# Altium schematic sheet SPI_Module.SchDoc
size A0
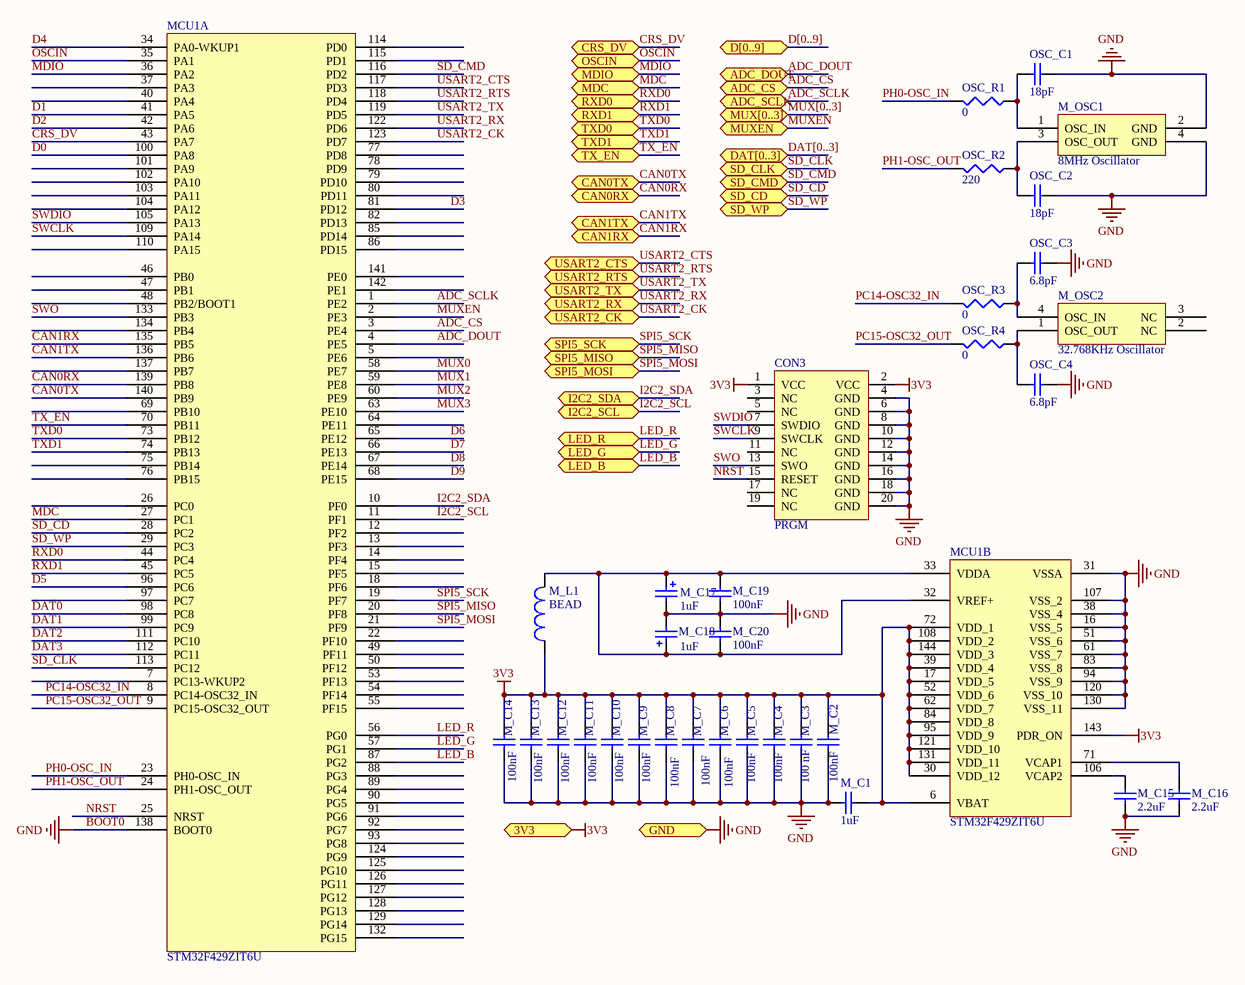
[diagram p0: SPI_Module.SchDoc]

## Parts
CON3  PRGM  [JTAG/SWO-20PIN]
M_C1  value 1uF  [SMD0603]  (hidden comment: Cap)
M_C2  value 100nF  [SMD0603]  (hidden comment: Cap)
M_C3  value 100 nF  [SMD0603]  (hidden comment: Cap)
M_C4  value 100nF  [SMD0603]  (hidden comment: Cap)
M_C5  value 100nF  [SMD0603]  (hidden comment: Cap)
M_C6  value 100nF  [SMD0603]  (hidden comment: Cap)
M_C7  value 100nF  [SMD0603]  (hidden comment: Cap)
M_C8  value 100nF  [SMD0603]  (hidden comment: Cap)
M_C9  value 100nF  [SMD0603]  (hidden comment: Cap)
M_C10  value 100nF  [SMD0603]  (hidden comment: Cap)
M_C11  value 100nF  [SMD0603]  (hidden comment: Cap)
M_C12  value 100nF  [SMD0603]  (hidden comment: Cap)
M_C13  value 100nF  [SMD0603]  (hidden comment: Cap)
M_C14  value 100nF  [SMD0603]  (hidden comment: Cap)
M_C15  value 2.2uF  [SMD1206]  (hidden comment: Cap)
M_C16  value 2.2uF  [SMD1206]  (hidden comment: Cap)
M_C17  value 1uF  [SMD1206 Polarized]  (hidden comment: Cap)
M_C18  value 1uF  [SMD1206 Polarized]  (hidden comment: Cap)
M_C19  value 100nF  [SMD0603]  (hidden comment: Cap)
M_C20  value 100nF  [SMD0603]  (hidden comment: Cap)
M_L1  BEAD  [SMD0603]
M_OSC1  8MHz Oscillator  [ABMM2-OSC]
M_OSC2  32.768KHz Oscillator  [MC-306-OSC]
MCU1  STM32F429ZIT6U  [LQPF144]  (parts A,B of 2)
OSC_C1  value 18pF  [SMD0603]  (hidden comment: Cap)
OSC_C2  value 18pF  [SMD0603]  (hidden comment: Cap)
OSC_C3  value 6.8pF  [SMD0603]  (hidden comment: Cap)
OSC_C4  value 6.8pF  [SMD0603]  (hidden comment: Cap)
OSC_R1  value 0  [SMD0603]  (hidden comment: Res)
OSC_R2  value 220  [SMD0603]  (hidden comment: Res)
OSC_R3  value 0  [SMD0603]  (hidden comment: Res)
OSC_R4  value 0  [SMD0603]  (hidden comment: Res)

## Ports
3V3, ADC_CS, ADC_DOUT, ADC_SCLK, CAN0RX, CAN0TX, CAN1RX, CAN1TX, CRS_DV, D[0..9], DAT[0..3], GND, I2C2_SCL, I2C2_SDA, LED_B, LED_G, LED_R, MDC, MDIO, MUX[0..3], MUXEN, OSCIN, RXD0, RXD1, SD_CD, SD_CLK, SD_CMD, SD_WP, SPI5_MISO, SPI5_MOSI, SPI5_SCK, TX_EN, TXD0, TXD1, USART2_CK, USART2_CTS, USART2_RTS, USART2_RX, USART2_TX

## Nets
3V3: CON3.1(VCC) CON3.2(VCC) M_C1.1 M_C2.1 M_C3.2 M_C4.2 M_C5.2 M_C6.2 M_C7.2 M_C8.2 M_C9.2 M_C10.2 M_C11.2 M_C12.2 M_C13.2 M_C14.2 M_L1.1 MCU1.6(VBAT) MCU1.17(VDD_5) MCU1.30(VDD_12) MCU1.39(VDD_4) MCU1.52(VDD_6) MCU1.62(VDD_7) MCU1.72(VDD_1) MCU1.84(VDD_8) MCU1.95(VDD_9) MCU1.108(VDD_2) MCU1.121(VDD_10) MCU1.131(VDD_11) MCU1.143(PDR_ON) MCU1.144(VDD_3) ; port 3V3
BOOT0: CON3.4(GND) CON3.6(GND) CON3.8(GND) CON3.10(GND) CON3.12(GND) CON3.14(GND) CON3.16(GND) CON3.18(GND) CON3.20(GND) M_C1.2 M_C2.2 M_C3.1 M_C4.1 M_C5.1 M_C6.1 M_C7.1 M_C8.1 M_C9.1 M_C10.1 M_C11.1 M_C12.1 M_C13.1 M_C14.1 M_C15.1 M_C16.1 M_C17.2 M_C18.2 M_C19.1 M_C20.2 M_OSC1.2(GND) M_OSC1.4(GND) MCU1.16(VSS_5) MCU1.31(VSSA) MCU1.38(VSS_4) MCU1.51(VSS_6) MCU1.61(VSS_7) MCU1.83(VSS_8) MCU1.94(VSS_9) MCU1.107(VSS_2) MCU1.120(VSS_10) MCU1.130(VSS_11) MCU1.138(BOOT0) OSC_C1.1 OSC_C2.1 OSC_C3.1 OSC_C4.1 ; port GND  [also labelled GND]
ADC_CS: MCU1.3(PE4) ; port ADC_CS
ADC_DOUT: MCU1.4(PE5) ; port ADC_DOUT
ADC_SCLK: MCU1.1(PE2) ; port ADC_SCLK
CAN0RX: MCU1.139(PB8) ; port CAN0RX
CAN0TX: MCU1.140(PB9) ; port CAN0TX
CAN1RX: MCU1.135(PB5) ; port CAN1RX
CAN1TX: MCU1.136(PB6) ; port CAN1TX
CRS_DV: MCU1.43(PA7) ; port CRS_DV
D0: MCU1.100(PA8)
D1: MCU1.41(PA5)
D2: MCU1.42(PA6)
D3: MCU1.81(PD12)
D4: MCU1.34(PA0-WKUP1)
D5: MCU1.96(PC6)
D6: MCU1.65(PE12)
D7: MCU1.66(PE13)
D8: MCU1.67(PE14)
D9: MCU1.68(PE15)
DAT0: MCU1.98(PC8)
DAT1: MCU1.99(PC9)
DAT2: MCU1.111(PC10)
DAT3: MCU1.112(PC11)
I2C2_SCL: MCU1.11(PF1) ; port I2C2_SCL
I2C2_SDA: MCU1.10(PF0) ; port I2C2_SDA
LED_B: MCU1.87(PG2) ; port LED_B
LED_G: MCU1.57(PG1) ; port LED_G
LED_R: MCU1.56(PG0) ; port LED_R
MDC: MCU1.27(PC1) ; port MDC
MDIO: MCU1.36(PA2) ; port MDIO
MUX0: MCU1.58(PE7)
MUX1: MCU1.59(PE8)
MUX2: MCU1.60(PE9)
MUX3: MCU1.63(PE10)
MUXEN: MCU1.2(PE3) ; port MUXEN
NRST: CON3.15(RESET) MCU1.25(NRST)
OSCIN: MCU1.35(PA1) ; port OSCIN
PC14-OSC32_IN: MCU1.8(PC14-OSC32_IN) OSC_R3.2
PC15-OSC32_OUT: MCU1.9(PC15-OSC32_OUT) OSC_R4.2
PH0-OSC_IN: MCU1.23(PH0-OSC_IN) OSC_R1.2
PH1-OSC_OUT: MCU1.24(PH1-OSC_OUT) OSC_R2.2
RXD0: MCU1.44(PC4) ; port RXD0
RXD1: MCU1.45(PC5) ; port RXD1
SD_CD: MCU1.28(PC2) ; port SD_CD
SD_CLK: MCU1.113(PC12) ; port SD_CLK
SD_CMD: MCU1.116(PD2) ; port SD_CMD
SD_WP: MCU1.29(PC3) ; port SD_WP
SPI5_MISO: MCU1.20(PF8) ; port SPI5_MISO
SPI5_MOSI: MCU1.21(PF9) ; port SPI5_MOSI
SPI5_SCK: MCU1.19(PF7) ; port SPI5_SCK
SWCLK: CON3.9(SWCLK) MCU1.109(PA14)
SWDIO: CON3.7(SWDIO) MCU1.105(PA13)
SWO: CON3.13(SWO) MCU1.133(PB3)
TX_EN: MCU1.70(PB11) ; port TX_EN
TXD0: MCU1.73(PB12) ; port TXD0
TXD1: MCU1.74(PB13) ; port TXD1
USART2_CK: MCU1.123(PD7) ; port USART2_CK
USART2_CTS: MCU1.117(PD3) ; port USART2_CTS
USART2_RTS: MCU1.118(PD4) ; port USART2_RTS
USART2_RX: MCU1.122(PD6) ; port USART2_RX
USART2_TX: MCU1.119(PD5) ; port USART2_TX
NetM_C15_2: M_C15.2 MCU1.106(VCAP2)
NetM_C16_2: M_C16.2 MCU1.71(VCAP1)
NetM_C17_1: M_C17.1 M_C18.1 M_C19.2 M_C20.1 M_L1.2 MCU1.32(VREF+) MCU1.33(VDDA)
NetM_OSC1_1: M_OSC1.1(OSC_IN) OSC_C1.2 OSC_R1.1
NetM_OSC1_3: M_OSC1.3(OSC_OUT) OSC_C2.2 OSC_R2.1
NetM_OSC2_1: M_OSC2.1(OSC_OUT) OSC_C4.2 OSC_R4.1
NetM_OSC2_4: M_OSC2.4(OSC_IN) OSC_C3.2 OSC_R3.1

Not connected (* = marked no-connect by the designer): CON3 3(NC) 5(NC) 11(NC) 17(NC) 19(NC); M_OSC2 2(NC) 3(NC); MCU1 5(PE6) 7(PC13-WKUP2) 12(PF2) 13(PF3) 14(PF4) 15(PF5) 18(PF6) 22(PF10) 26(PC0) 37(PA3) 40(PA4) 46(PB0) 47(PB1) 48(PB2/BOOT1) 49(PF11) 50(PF12) 53(PF13) 54(PF14) 55(PF15) 64(PE11) 69(PB10) 75(PB14) 76(PB15) 77(PD8) 78(PD9) 79(PD10) 80(PD11) 82(PD13) 85(PD14) 86(PD15) 88(PG3) 89(PG4) 90(PG5) 91(PG6) 92(PG7) 93(PG8) 97(PC7) 101(PA9) 102(PA10) 103(PA11) 104(PA12) 110(PA15) 114(PD0) 115(PD1) 124(PG9) 125(PG10) 126(PG11) 127(PG12) 128(PG13) 129(PG14) 132(PG15) 134(PB4) 137(PB7) 141(PE0) 142(PE1)

## Buses and harness runs
bus D[0..9] = port D[0..9]
bus DAT[0..3] = port DAT[0..3]
bus MUX[0..3] = port MUX[0..3]

## Library data of the parts
CON3 = JTAG/SWO-20PIN
M_C1-M_C16 M_C19 M_C20 OSC_C1-OSC_C4 = Capacitor Ceramic: Ceramic Chip Capacitor
M_C17 M_C18 = Capacitor Polarized: Polarized Capacitor (Surface Mount)
M_L1 = Chip Ferrite Bead: Ferrite Bead; Part: BK1608HS601-TV
M_OSC1 = ABMM2-8.000MHZ-E2-T
M_OSC2 = MC-306 32.768K-E3: 32.7680kHz Oscillator
OSC_R1-OSC_R4 = Resistor